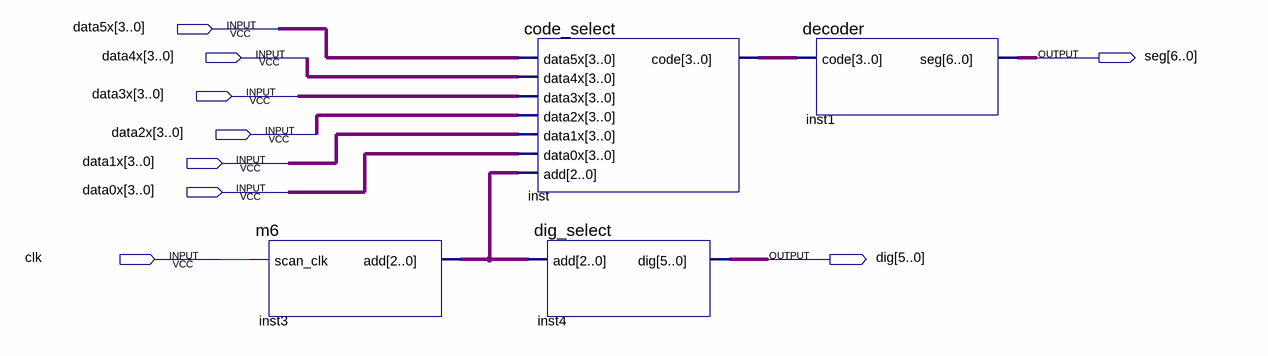
[diagram p0: schematic sheet]
// Quartus schematic display.bdf as structural Verilog: 4 symbols, 9 pins
module display (
  input  [3:0] data5x,
  input  [3:0] data4x,
  input  [3:0] data3x,
  input  [3:0] data2x,
  input  [3:0] data1x,
  input  [3:0] data0x,
  input  clk,
  output [6:0] seg,
  output [5:0] dig
);

  wire [2:0] inst3_add;
  wire [3:0] inst_code;

  m6 inst3 (.scan_clk(clk), .add(inst3_add));
  code_select inst (
    .data5x(data5x), .data4x(data4x), .data3x(data3x), .data2x(data2x), .data1x(data1x), .data0x(data0x),
    .add(inst3_add), .code(inst_code));
  dig_select inst4 (.add(inst3_add), .dig(dig));
  decoder inst1 (.code(inst_code), .seg(seg));
endmodule
